# Altium schematic sheet LED.SchDoc: FLASH LIGHT
size A4; SheetSize: A4
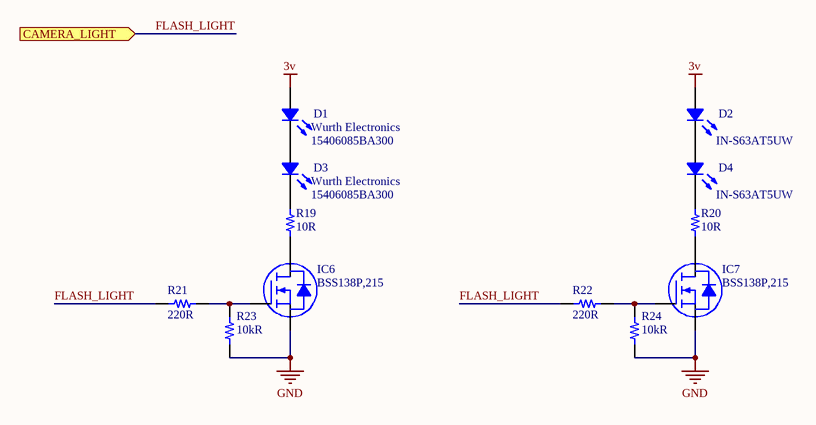
[diagram p0: LED.SchDoc]

## Parts
D1  15406085BA300  Manufacturer: Wurth Electronics  [LED 0603/1608]
D2  IN-S63AT5UW  [LED 0603/1608]
D3  15406085BA300  Manufacturer: Wurth Electronics  [LED 0603/1608]
D4  IN-S63AT5UW  [LED 0603/1608]
IC6  BSS138P,215  [DIODES SOT-23-3]
IC7  BSS138P,215  [DIODES SOT-23-3]
R19  10R  [RES 0603/1608]
R20  10R  [RES 0603/1608]
R21  220R  [RES 0603/1608]
R22  220R  [RES 0603/1608]
R23  10kR  [RES 0603/1608]
R24  10kR  [RES 0603/1608]

## Ports
CAMERA_LIGHT (in)

## Nets
3v: D1.1 D2.1
GND: IC6.2(S) IC7.2(S) R23.2 R24.2
FLASH_LIGHT: R21.1 R22.1 ; port CAMERA_LIGHT
NetD1_2: D1.2 D3.1
NetD2_2: D2.2 D4.1
NetD3_2: D3.2 R19.2
NetD4_2: D4.2 R20.2
NetIC6_1: IC6.1(G) R21.2 R23.1
NetIC6_3: IC6.3(D) R19.1
NetIC7_1: IC7.1(G) R22.2 R24.1
NetIC7_3: IC7.3(D) R20.1

## Notes on the sheet
- Title:
- Size:
- Project:
- Revision:
- Sheet
- of
- Date:
- YıLDıZ IoT
- Elperek Mahallesi
- Saray Sokak, No:12
- SAKARYA / TURKEY
- File:

## Library data of the parts
D1 D3 = LED: Chip LED; Supplier 1: Digi-Key; Supplier Part Number 1: 732-12005-1-ND; Manufacturer Part Number: 15406085BA300; Stock 1: 3808; Pricing 1: 1 = 0,60000, 10 = 0,54200, 100 = 0,50400, 500 = 0,46600, 1000 = 0,42800 (USD); RoHS: No; ComponentLink1URL: http://katalog.we-online.de/pbs/datasheet/15406085BA300.pdf?src-supplier=Digi-Key; ComponentLink1Description: http://katalog.we-online.de/pbs/datasheet/15406085BA300.pdf?src-supplier=Digi-Key
D2 D4 = LED: Chip LED; Manufacturer: Inolux; Color: White; Lens Color: Clear; Lens Style: Flat; Luminous Intensity: 900mcd; Forward Voltage: 3V; Test Current: 5mA; Viewing Angle: 120°; Lens Size: 0.8mm; ComponentLink1URL: http://katalog.we-online.de/pbs/datasheet/15406085BA300.pdf?src-supplier=Digi-Key; ComponentLink1Description: http://katalog.we-online.de/pbs/datasheet/15406085BA300.pdf?src-supplier=Digi-Key; Supplier 1: Digi-Key; Supplier Part Number 1: 1830-1063-1-ND; Manufacturer Part Number: IN-S63AT5UW; Stock 1: 44672; Pricing 1: 1 = 0,33000, 10 = 0,24000, 100 = 0,11360, 500 = 0,07576, 1000 = 0,05934 (USD); RoHS: No; Mount: Surface Mount; Case/Package: 0603; Case Code (Imperial): 0603; Case Code (Metric): 1608; Packaging: Tape and Reel; Lens Transparency: Clear; Length: 1.6mm; Height: 0.4mm; Width: 0.8mm; ComponentLink2URL: http://www.inolux-corp.com/datasheet/SMDLED/Mono%20Color%20Top%20View/IN-S63AT%20Series_V1.1.pdf?src-supplier=Digi-Key; ComponentLink2Description: http://www.inolux-corp.com/datasheet/SMDLED/Mono%20Color%20Top%20View/IN-S63AT%20Series_V1.1.pdf?src-supplier=Digi-Key
IC6 IC7 = BSS138-7-F: MOSFET N-CH 50V 200MA SOT23-3; Manufacturer: Nexperia; ComponentLink1Description: Datasheet; ComponentLink1URL: https://www.diodes.com/assets/Datasheets/ds30144.pdf; ComponentLink2Description: DigiKey Link; ComponentLink2URL: http://digikey.com/product-detail/en/diodes-incorporated/BSS138-7-F/BSS138-FDICT-ND/717843; Supplier 1: Digi-Key; Supplier Part Number 1: 1727-1142-1-ND; Manufacturer Part Number: BSS138P,215; Stock 1: 720934; Pricing 1: 1 = 0,16000, 10 = 0,14400, 25 = 0,13760, 100 = 0,06050, 250 = 0,05808, 500 = 0,04752, 1000 = 0,03300 (USD); RoHS: No; ComponentLink3URL: http://www.farnell.com/datasheets/923164.pdf?src-supplier=Farnell; ComponentLink3Description: http://www.farnell.com/datasheets/923164.pdf?src-supplier=Farnell; ComponentLink4URL: https://www.mouser.com/ds/2/302/BSS138P-114022.pdf?src-supplier=Mouser; ComponentLink4Description: https://www.mouser.com/ds/2/302/BSS138P-114022.pdf?src-supplier=Mouser; ComponentLink5URL: https://assets.nexperia.com/documents/data-sheet/BSS138P.pdf?src-supplier=Digi-Key; ComponentLink5Description: https://assets.nexperia.com/documents/data-sheet/BSS138P.pdf?src-supplier=Digi-Key; ComponentLink6URL: http://www.farnell.com/datasheets/923164.pdf?src-supplier=Newark; ComponentLink6Description: http://www.farnell.com/datasheets/923164.pdf?src-supplier=Newark
R19 R20 = Resistor_Chip: Ceramic, SMT Capacitor; Manufacturer: Yageo; Manufacturer Part Number: RC0603FR-0710RL; Tolerance: 1%; Voltage Rating (DC): 50V; Temperature Coefficient: 200ppm/°C; Power Rating: 100mW; Supplier 1: Digi-Key; Supplier Part Number 1: 311-10.0HRCT-ND; Stock 1: 10914948; Pricing 1: 1 = 0,10000, 10 = 0,04600, 100 = 0,01870, 1000 = 0,00840, 2500 = 0,00729 (USD); RoHS: Yes; Case/Package: 0603; Number of Pins: 2; Case Code (Imperial): 0603; Case Code (Metric): 1608; Contact Plating: Tin,Matte; Min Operating Temperature: -55°C; Max Operating Temperature: 155°C; Packaging: Tape and Reel; Resistance: 10R; Composition: Thick Film; Voltage Rating: 50V; Termination: SMD/SMT; Military Standard: Not; Length: 1.6mm; Height: 0.45mm; Width: 0.8mm; Depth: 0.8mm; Radiation Hardening: No; Lead Free: Lead Free; REACH SVHC: No SVHC; ComponentLink1URL: https://datasheet.ciiva.com/11808/0900766b80f96399-11808140.pdf?src-supplier=RSComponents; ComponentLink1Description: https://datasheet.ciiva.com/11808/0900766b80f96399-11808140.pdf?src-supplier=RSComponents; ComponentLink2URL: https://datasheet.ciiva.com/7746/443971-7746245.pdf?src-supplier=Element14; ComponentLink2Description: https://datasheet.ciiva.com/7746/443971-7746245.pdf?src-supplier=Element14; ComponentLink3URL: https://datasheet.ciiva.com/28386/pyu-rc0603-51-rohs-l-4-28386637.pdf?src-supplier=Avnet+Europe; ComponentLink3Description: https://datasheet.ciiva.com/28386/pyu-rc0603-51-rohs-l-4-28386637.pdf?src-supplier=Avnet+Europe; ComponentLink4URL: https://datasheet.ciiva.com/8891/pyu-rc0603-51-rohs-l-4-8891285.pdf?src-supplier=Avnet; ComponentLink4Description: https://datasheet.ciiva.com/8891/pyu-rc0603-51-rohs-l-4-8891285.pdf?src-supplier=Avnet
R21 R22 = Resistor_Chip: Ceramic, SMT Capacitor; Manufacturer: Yageo; Manufacturer Part Number: RC0603FR-07220RL; Tolerance: 1%; Voltage Rating (DC): 50V; Temperature Coefficient: 100ppm/°C; Power Rating: 100mW; Supplier 1: Digi-Key; Supplier Part Number 1: 311-220HRCT-ND; Stock 1: 5261609; Pricing 1: 1 = 0,10000, 10 = 0,02300, 100 = 0,00940, 1000 = 0,00421, 2500 = 0,00366 (USD); RoHS: Yes; Case/Package: 0603; Number of Pins: 2; Case Code (Imperial): 0603; Case Code (Metric): 1608; Min Operating Temperature: -55°C; Max Operating Temperature: 155°C; Resistance: 220R; Packaging: Tape and Reel; Composition: Thick Film; Voltage Rating: 50V; Package Quantity: 1; Features: Moisture Resistant; Max Power Dissipation: 100mW; Termination: SMD/SMT; Number of Terminations: 2; Military Standard: Not; Length: 1.6mm; Height: 0.022inch; Width: 0.031inch; Depth: 0.8mm; Lead Free: Lead Free; REACH SVHC: No SVHC; ComponentLink1URL: https://datasheet.ciiva.com/2453/pyu-r-int-thick-7-2453973.pdf?src-supplier=Digi-Key; ComponentLink1Description: https://datasheet.ciiva.com/2453/pyu-r-int-thick-7-2453973.pdf?src-supplier=Digi-Key; ComponentLink2URL: https://datasheet.ciiva.com/2453/pyu-r-int-thick-7-2453974.pdf?src-supplier=Digi-Key; ComponentLink2Description: https://datasheet.ciiva.com/2453/pyu-r-int-thick-7-2453974.pdf?src-supplier=Digi-Key; ComponentLink3URL: https://datasheet.ciiva.com/2453/pyu-r-int-thick-7-2453975.pdf?src-supplier=Digi-Key; ComponentLink3Description: https://datasheet.ciiva.com/2453/pyu-r-int-thick-7-2453975.pdf?src-supplier=Digi-Key; ComponentLink4URL: https://datasheet.ciiva.com/7746/1738695-7746300.pdf?src-supplier=Element14; ComponentLink4Description: https://datasheet.ciiva.com/7746/1738695-7746300.pdf?src-supplier=Element14; ComponentLink5URL: https://datasheet.ciiva.com/7746/1738695-7746301.pdf?src-supplier=Element14; ComponentLink5Description: https://datasheet.ciiva.com/7746/1738695-7746301.pdf?src-supplier=Element14
R23 R24 = Resistor_Chip: Ceramic, SMT Capacitor; Manufacturer: Stackpole Electronics; Manufacturer Part Number: RNCP0603FTD10K0; Tolerance: 1%; Max Power Dissipation: 125mW; Temperature Coefficient: 100ppm/°C; Supplier 1: Digi-Key; Supplier Part Number 1: RNCP0603FTD10K0CT-ND; Stock 1: 183083; Pricing 1: 1 = 0,10000, 10 = 0,06700, 100 = 0,02730, 1000 = 0,01224, 2500 = 0,01063 (USD); RoHS: Yes; Mount: Surface Mount; Case/Package: 0603; Case Code (Metric): 1608; Case Code (Imperial): 0603; Contact Plating: Matte,Tin; Min Operating Temperature: -55°C; Max Operating Temperature: 155°C; Packaging: Tape and Reel; Resistance: 10kR; Composition: Thin Film; Number of Terminations: 2; Features: Anti-Sulfur,Moisture Resistant; Length: 0.059inch; Height: 0.02inch; Width: 0.031inch; Radiation Hardening: No; Lead Free: Lead Free